# EAGLE design Stout IEEE full dev board (EAGLE 6.3)
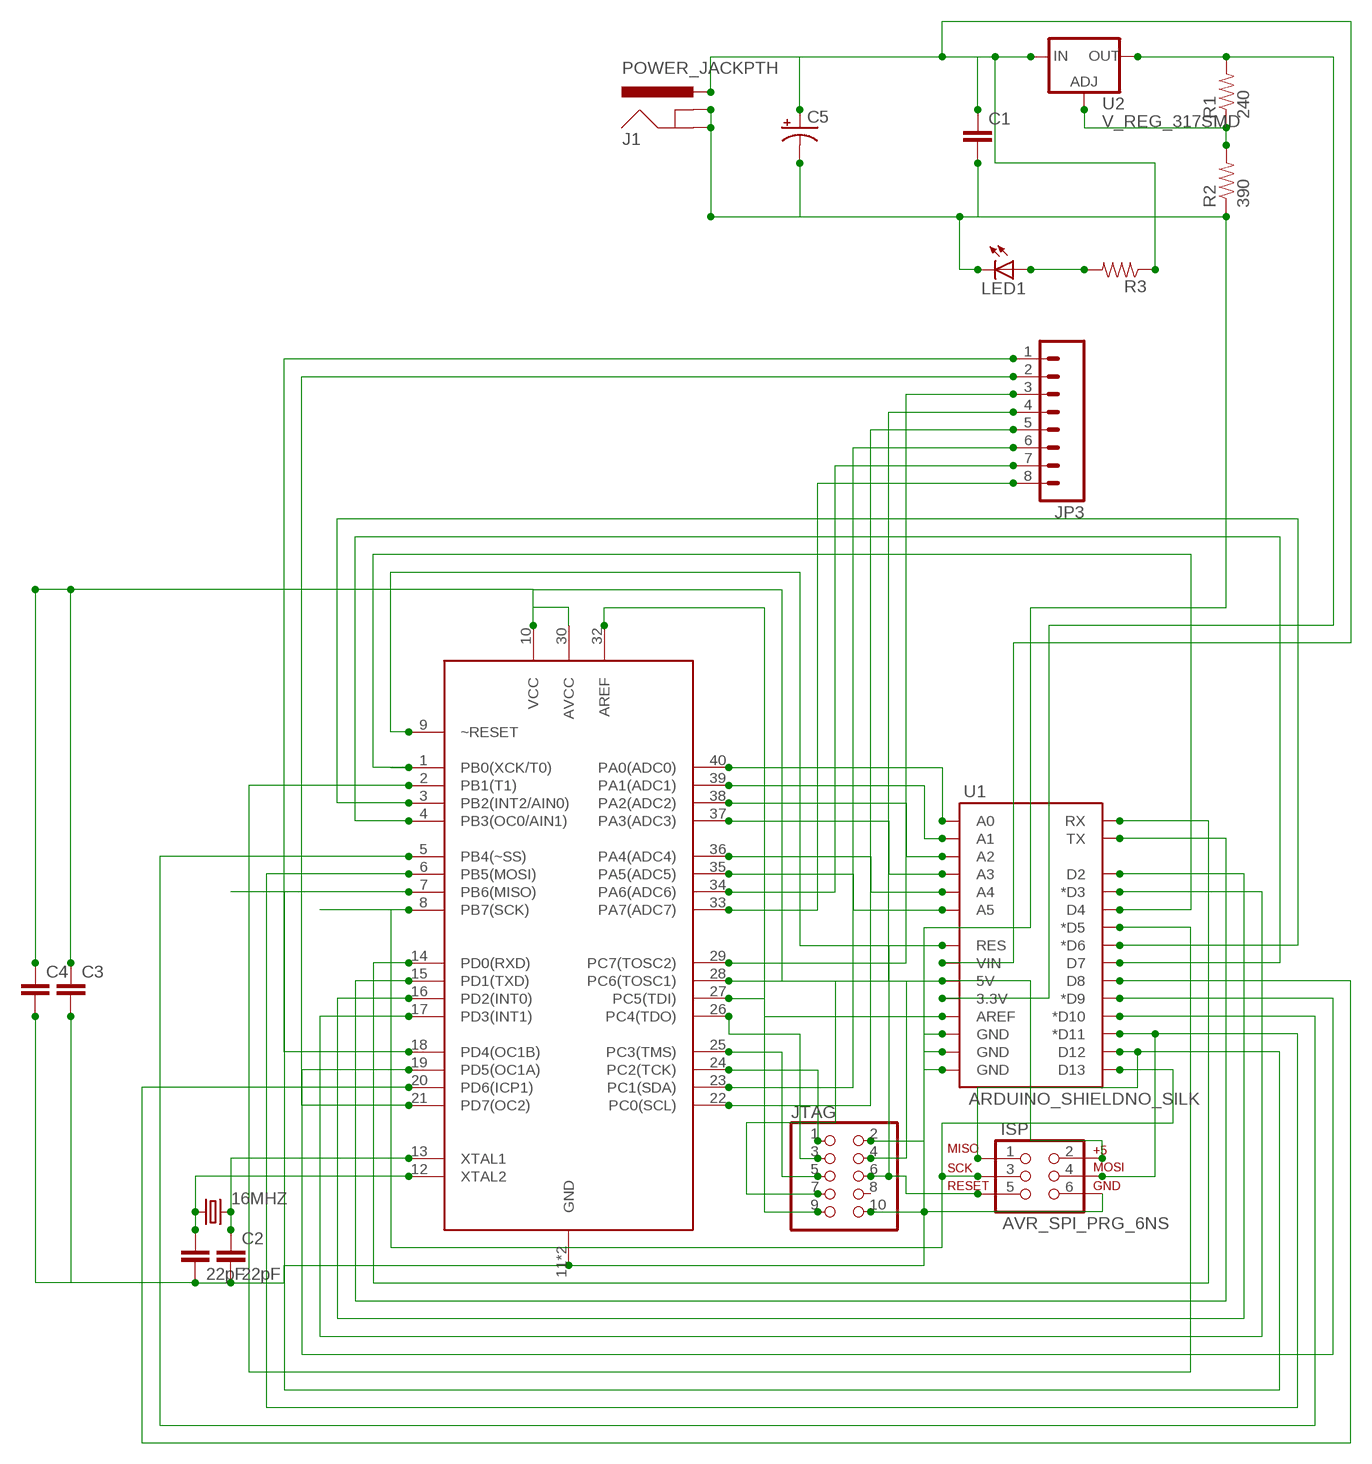
[diagram p0: schematic, sheet 1]

## Parts
16MHZ  CRYSTALHC49UV  [HC49U-V]
22PF  22pF  CAPPTH  [CAP-PTH-SMALL]
C1  CAPPTH  [CAP-PTH-SMALL]
C2  22pF  CAPPTH  [CAP-PTH-SMALL]
C3  CAPPTH  [CAP-PTH-SMALL]
C4  CAPPTH  [CAP-PTH-SMALL]
C5  CAP_POLPTH2  [CPOL-RADIAL-10UF-25V]
ISP  AVR_SPI_PRG_6NS  [2X3-NS]
J1  POWER_JACKPTH  [POWER_JACK_PTH]
JP3  M08  [1X08]
JTAG  PINHD-2X5  [2X05]
LED1  LED3MM  [LED3MM]
R1  240  RESISTORPTH1  [AXIAL-0.3]
R2  390  RESISTORPTH1  [AXIAL-0.3]
R3  RESISTORPTH1  [AXIAL-0.3]
U1  ARDUINO_SHIELDNO_SILK  [DUEMILANOVE_VIAS]
U2  V_REG_317SMD  [SOT223]
U$1  ATMEGA16  [40-DIP]

## Nets
GND: 22PF.2 C1.2 C2.2 C3.2 C4.2 C5.2(-) ISP.6 J1.GND J1.GNDBREAK JTAG.2 JTAG.10 LED1.K(C) R2.P$1 U1.GND@0(GND) U1.GND@1(GND) U1.GND@2(GND) U$1.11(GND) U$1.31(GND)
MISO: ISP.1 U1.D12 U$1.7(PB6(MISO))
MOSI: ISP.4 U1.D11(*D11) U$1.6(PB5(MOSI))
N$1: U1.A0 U$1.40(PA0(ADC0))
N$2: U1.A1 U$1.39(PA1(ADC1))
N$3: U1.A2 U$1.38(PA2(ADC2))
N$4: U1.A3 U$1.37(PA3(ADC3))
N$5: U1.A4 U$1.36(PA4(ADC4))
N$6: U1.A5 U$1.35(PA5(ADC5))
N$7: R1.P$2 U1.3.3V U2.2(OUT)
N$8: JP3.8 U$1.33(PA7(ADC7))
N$9: JP3.7 U$1.34(PA6(ADC6))
N$10: R1.P$1 R2.P$2 U2.1(ADJ)
N$11: U1.AREF U$1.32(AREF)
N$12: C1.1 C5.1(+) J1.PWR R3.P$1 U1.VIN U2.3(IN)
N$13: U1.RX U$1.14(PD0(RXD))
N$14: U1.TX U$1.15(PD1(TXD))
N$15: U1.D2 U$1.16(PD2(INT0))
N$16: U1.D3(*D3) U$1.17(PD3(INT1))
N$17: 16MHZ.2 C2.1 U$1.13(XTAL1)
N$18: 16MHZ.1 22PF.1 U$1.12(XTAL2)
N$19: JP3.6 U$1.23(PC1(SDA))
N$20: JP3.5 U$1.22(PC0(SCL))
N$21: U1.D4 U$1.1(PB0(XCK/T0))
N$22: U1.D8 U$1.20(PD6(ICP1))
N$23: LED1.A R3.P$2
N$24: U1.D10(*D10) U$1.5(PB4(~SS))
N$25: U1.D5(*D5) U$1.2(PB1(T1))
N$26: U1.D9(*D9) U$1.19(PD5(OC1A))
N$27: U1.D7 U$1.4(PB3(OC0/AIN1))
N$28: U1.D6(*D6) U$1.3(PB2(INT2/AIN0))
N$29: JTAG.1 U$1.24(PC2(TCK))
N$30: JTAG.3 U$1.26(PC4(TDO))
N$31: JTAG.5 U$1.25(PC3(TMS))
N$32: JTAG.9 U$1.27(PC5(TDI))
N$33: JP3.2 U$1.21(PD7(OC2))
N$34: JP3.1 U$1.18(PD4(OC1B))
N$35: JP3.4 U$1.28(PC6(TOSC1))
N$36: JP3.3 U$1.29(PC7(TOSC2))
RESET: ISP.5 JTAG.6 U1.RES U$1.9(~RESET)
SCK: ISP.3 U1.D13 U$1.8(PB7(SCK))
VCC: C3.1 C4.1 ISP.2 JTAG.4 JTAG.7 U1.5V U$1.10(VCC) U$1.30(AVCC)
Unconnected: JTAG.8

## Library data of the parts
16MHZ = SparkFun-FreqCtrl:CRYSTAL: Various standard crystals. Proven footprints. Spark Fun Electronics SKU : COM-00534
22PF C2 = SparkFun:CAP: Capacitor Standard 0603 ceramic capacitor, and 0.1" leaded capacitor.
C1 C3 C4 = 1x05smd:CAP: Capacitor Standard 0603 ceramic capacitor, and 0.1" leaded capacitor.
C5 = 1x05smd:CAP_POL: Capacitor Polarized These are standard SMD and PTH capacitors. Normally 10uF, 47uF, and 100uF in electrolytic and tantalum varieties. Always verify the external diameter of the through hole cap, it varies with capacity, voltage, and manufacturer. The EIA devices should be standard.
ISP = SparkFun:AVR_SPI_PRG_6: AVR ISP 6 Pin This is the reduced ISP connector for AVR programming. Common on Arduino. This footprint will take up less PCB space and can be used with a 10-pin to 6-pin adapter such as SKU: BOB-08508
J1 = SparkFun:POWER_JACK: Power Jack This is the standard 5.5mm barrel jack for power. The PTH is the most common, proven, reliable, footprint. All others are experimental. The Slot footprint only works if the mill layer is transmitted to the PCB fab house so be warned. Spark Fun Electronics SKU : PRT-00119. Mating wall wart : TOL-00298 (and others)
JP3 = SparkFun:M08: Header 8 Standard 8-pin 0.1" header. Use with straight break away headers (SKU : PRT-00116), right angle break away headers (PRT-00553), swiss pins (PRT-00743), machine pins (PRT-00117), and female headers (PRT-00115).
JTAG = pinhead:PINHD-2X5: PIN HEADER
LED1 = adafruit:LED: LED OSRAM: - CHIPLED LG R971, LG N971, LY N971, LG Q971, LY Q971, LO R971, LY R971 LH N974, LH R974 LS Q976, LO Q976, LY Q976 LO Q996 - Hyper CHIPLED LW Q18S LB Q993, LB Q99A, LB R99A - SideLED LS A670, LO A670, LY A670, LG A670, LP A670 LB A673, LV A673, LT A673, LW A673 LH A674 LY A675 LS A676, LA A676, LO A676, LY A676, LW A676 LS A679, LY A679, LG A679 - Hyper Micro SIDELED® LS Y876, LA Y876, LO Y876, LY Y876 LT Y87S - SmartLED LW L88C, LW L88S LB L89C, LB L89S, LG L890 LS L89K, LO L89K, LY L89K LS L896, LA L896, LO L896, LY L896 - TOPLED LS T670, LO T670, LY T670, LG T670, LP T670 LSG T670, LSP T670, LSY T670, LOP T670, LYG T670 LG T671, LOG T671, LSG T671 LB T673, LV T673, LT T673, LW T673 LH T674 LS T676, LA T676, LO T676, LY T676, LB T676, LH T676, LSB T676, LW T676 LB T67C, LV T67C, LT T67C, LS T67K, LO T67K, LY T67K, LW E67C LS E67B, LA E67B, LO E67B, LY E67B, LB E67C, LV E67C, LT E67C LW T67C LS T679, LY T679, LG T679 LS T770, LO T770, LY T770, LG T770, LP T770 LB T773, LV T773, LT T773, LW T773 LH T774 LS E675, LA E675, LY E675, LS T675 LS T776, LA T776, LO T776, LY T776, LB T776 LHGB T686 LT T68C, LB T68C - Hyper Mini TOPLED® LB M676 - Mini TOPLED Santana® LG M470 LS M47K, LO M47K, LY M47K Source: http://www.osram.convergy.de/
R1-R3 = 1x05smd:RESISTOR: Resistor Basic schematic elements and footprints for 0603, 1206, and PTH 1/10th watt (small) resistors.
U1 = SparkFun-Boards:ARDUINO_SHIELD: Arduino shield footprint
U2 = SparkFun-PowerIC:V_REG_317: Voltage Regulator Standard LM317 adjustable voltage regulator. AOI (Adjust Output Input). Google 'LM317 Calculator' for easy to use app to get the two resistor values needed. 240/720 for 5V output. 240/390 for 3.3V output. Spark Fun Electronics SKU : COM-00527
U$1 = Strutz Electronic Industries:ATMEGA16

## Board
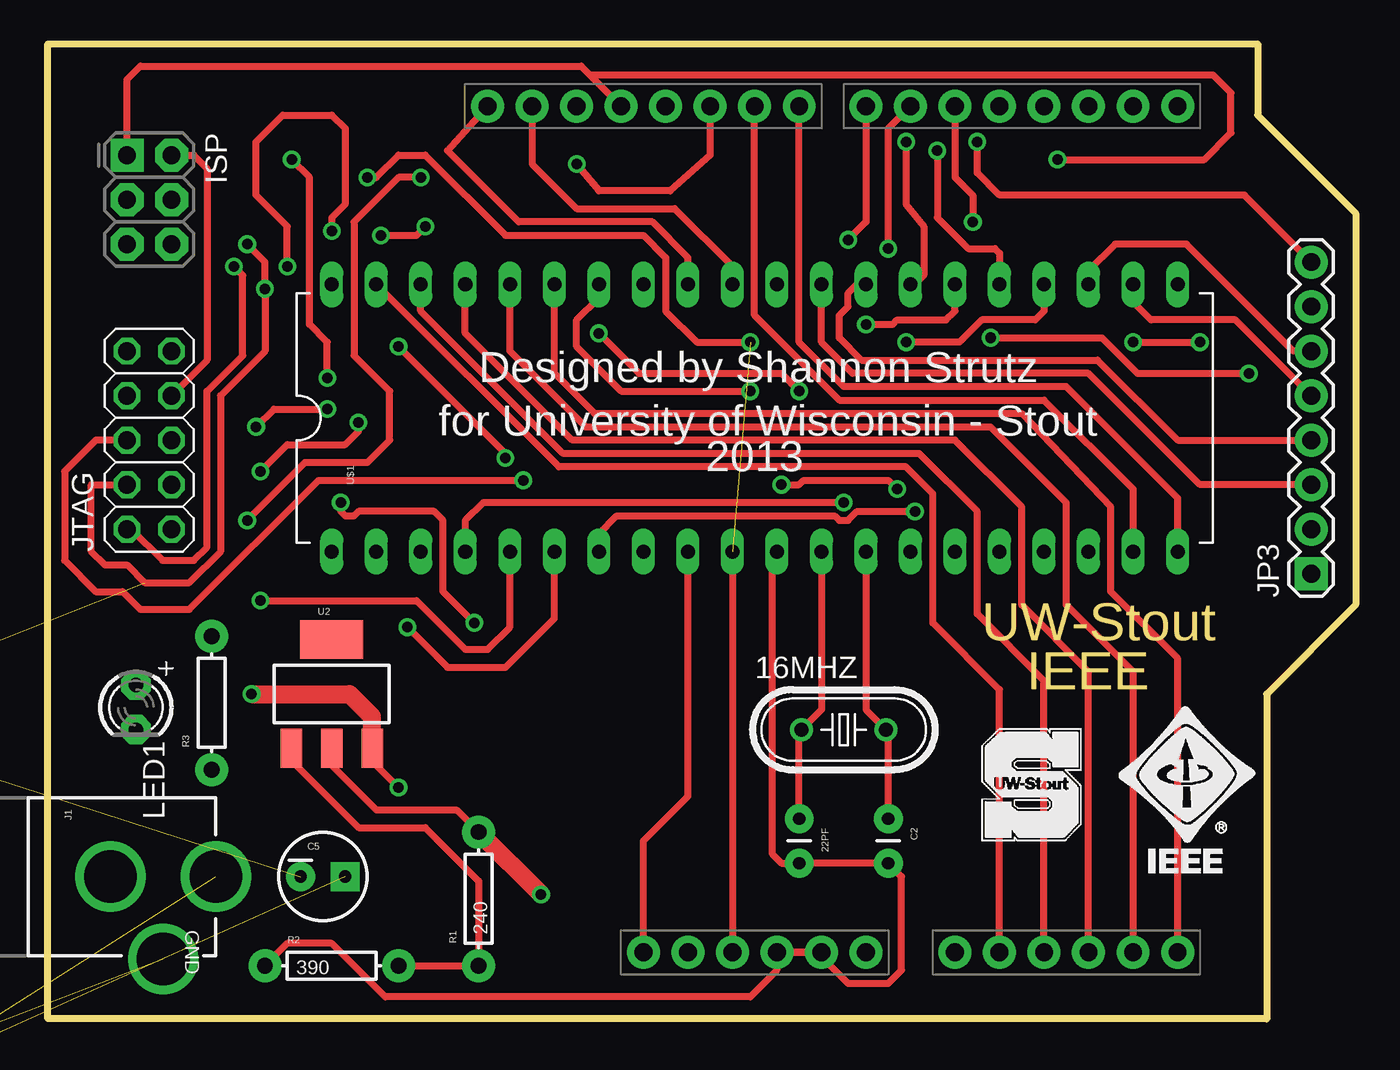
[diagram p1: board, top side]
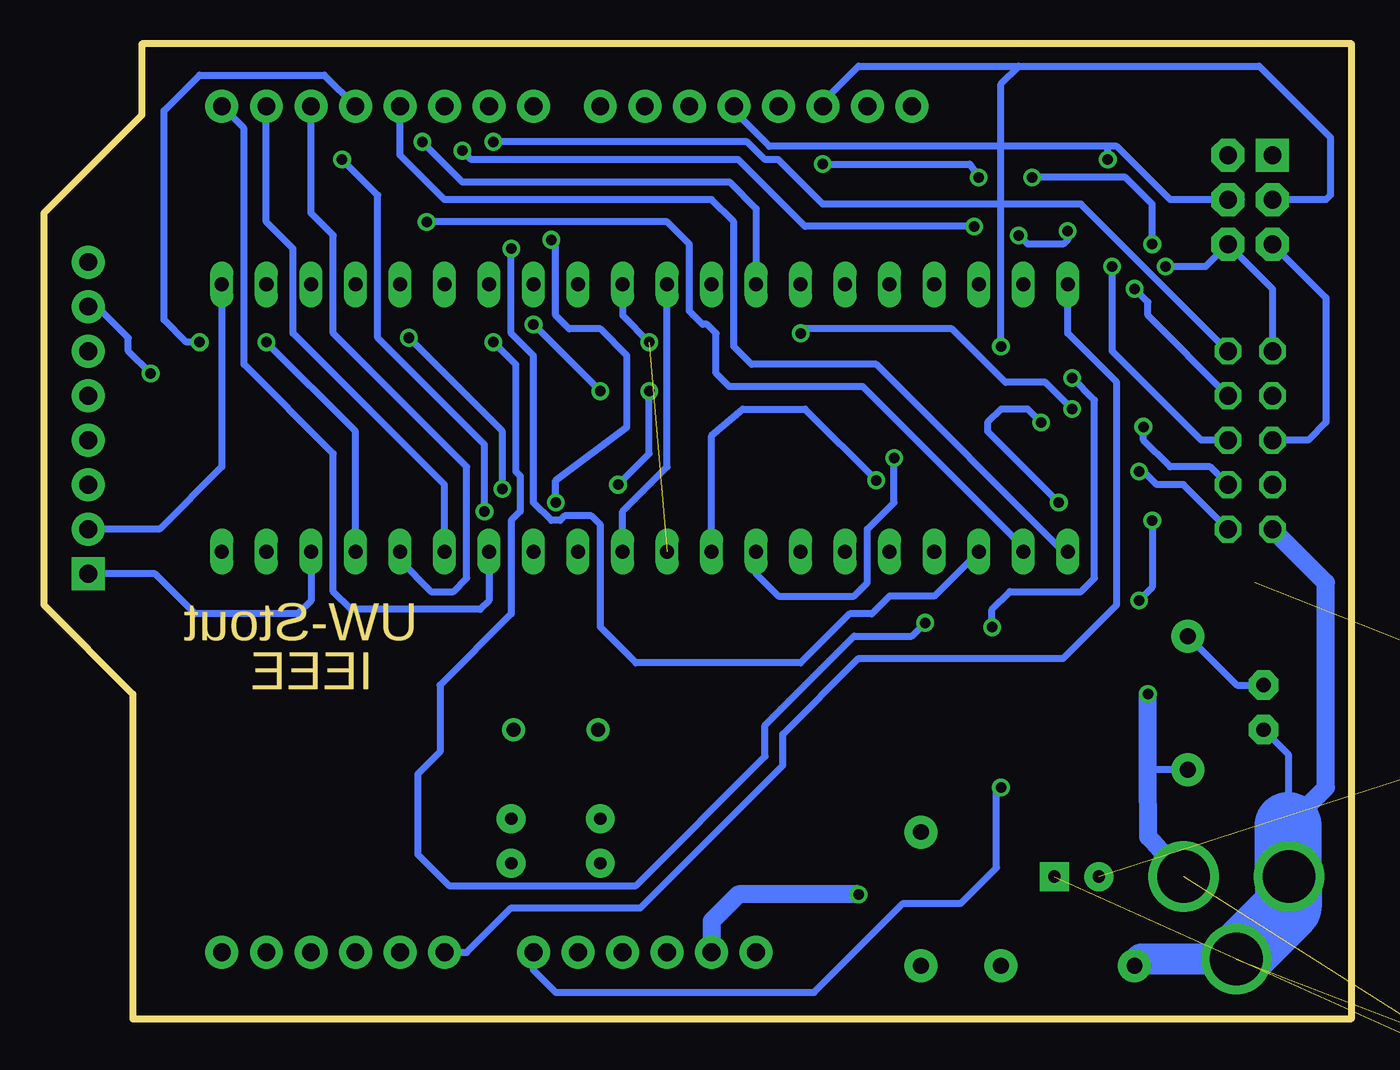
[diagram p2: board, bottom side, seen from below]

Size 74.63 x 55.63 mm. Coordinates in mm from the lower left corner, seen from the top.
Outline: 69.55,0.03 69.55,18.54 74.63,23.62 74.63,45.97 69.04,51.56 69.04,55.63 0,55.63 0,0.03 69.55,0.03
Outline: 69.55,0.03 69.55,0
Copper layers (1*16): Top 0.035mm / dielectric 1.5mm / Bottom 0.035mm
Design rules "default": minimum track width 10mil, minimum drill 24mil, track to track 8mil, track to pad 8mil, pad to pad 8mil, via to via 8mil, smd to smd 8mil, copper to edge 40mil, drill to drill 8mil, minimum pad ring 10mil, minimum via ring 8mil, stop-mask expansion 4mil, vias tented up to drill 0mil, thermal gap 10mil

### Footprints (pad centres in the part's own frame; a part is rotated, then mirrored left to right if it is on the bottom)
HC49U-V = drill 0.813: 1 -2.413,0; 2 2.413,0
CAP-PTH-SMALL = drill 0.7 pad 1.651: 1 0,0; 2 2.54,0
CPOL-RADIAL-10UF-25V = drill 0.7 pad 1.651 square: 1 1.27,0 | drill 0.7 pad 1.651: 2 -1.27,0
2X3-NS = drill 1.016 pad 1.88 square: 1 -2.54,-1.27 | drill 1.016 pad 1.88 octagon: 2 -2.54,1.27; 3 0,-1.27; 4 0,1.27; 5 2.54,-1.27; 6 2.54,1.27
POWER_JACK_PTH = drill 2.997: GND 0,7.7; GNDBREAK 4.7,10.7; PWR 0,13.7
1X08 = drill 1.016 pad 1.88 square: 1 0,0 | drill 1.016 pad 1.88: 2 2.54,0; 3 5.08,0; 4 7.62,0; 5 10.16,0; 6 12.7,0; 7 15.24,0; 8 17.78,0
2X05 = drill 1.016 octagon: 1 -5.08,-1.27; 2 -5.08,1.27; 3 -2.54,-1.27; 4 -2.54,1.27; 5 0,-1.27; 6 0,1.27; 7 2.54,-1.27; 8 2.54,1.27; 9 5.08,-1.27; 10 5.08,1.27
LED3MM = drill 0.813 pad 1.676 octagon: A -1.27,0; K 1.27,0
AXIAL-0.3 = drill 0.9 pad 1.88: P$1 -3.81,0; P$2 3.81,0
DUEMILANOVE_VIAS = drill 1.016 pad 1.88: 3.3V 50.8,13.97; 5V 50.8,16.51; A0 50.8,29.21; A1 50.8,31.75; A2 50.8,34.29; A3 50.8,36.83; A4 50.8,39.37; A5 50.8,41.91; AREF 2.54,2.54; D2 2.54,36.83; D3 2.54,34.29; D4 2.54,31.75; D5 2.54,29.21; D6 2.54,26.67; D7 2.54,24.13; D8 2.54,20.32; D9 2.54,17.78; D10 2.54,15.24; D11 2.54,12.7; D12 2.54,10.16; D13 2.54,7.62; GND@0 50.8,19.05; GND@1 50.8,21.59; GND@2 2.54,5.08; RES 50.8,11.43; RX 2.54,41.91; TX 2.54,39.37; VIN 50.8,24.13
SOT223 = smd 1.219 x 2.235: 1 -2.311,-3.099; 2 0,-3.099; 3 2.311,-3.099 | smd 3.6 x 2.2: 4 0,3.099
40-DIP = drill 0.8 long: 1 -7.62,24.13; 2 -7.62,21.59; 3 -7.62,19.05; 4 -7.62,16.51; 5 -7.62,13.97; 6 -7.62,11.43; 7 -7.62,8.89; 8 -7.62,6.35; 9 -7.62,3.81; 10 -7.62,1.27; 11 -7.62,-1.27; 12 -7.62,-3.81; 13 -7.62,-6.35; 14 -7.62,-8.89; 15 -7.62,-11.43; 16 -7.62,-13.97; 17 -7.62,-16.51; 18 -7.62,-19.05; 19 -7.62,-21.59; 20 -7.62,-24.13; 21 7.62,-24.13; 22 7.62,-21.59; 23 7.62,-19.05; 24 7.62,-16.51; 25 7.62,-13.97; 26 7.62,-11.43; 27 7.62,-8.89; 28 7.62,-6.35; 29 7.62,-3.81; 30 7.62,-1.27; 31 7.62,1.27; 32 7.62,3.81; 33 7.62,6.35; 34 7.62,8.89; 35 7.62,11.43; 36 7.62,13.97; 37 7.62,16.51; 38 7.62,19.05; 39 7.62,21.59; 40 7.62,24.13

### Placement (x,y rotation side)
16MHZ  45.42,16.51 0 top
22PF  42.88,11.43 270 top
C1  -8.43,-3.3 180 top  (outside the outline)
C2  47.96,11.43 270 top
C3  -15.04,16.76 0 top  (outside the outline)
C4  -17.58,9.14 0 top  (outside the outline)
C5  15.7,8.13 0 top
ISP  5.79,46.74 270 top
J1  -4.11,8.13 270 top
JP3  72.09,25.4 90 top
JTAG  5.79,33.02 90 top
LED1  5.03,17.78 270 top
R1  24.59,6.86 90 top
R2  16.21,3.05 0 top
R3  9.35,18.03 90 top
U1  22.56,54.61 270 top
U2  16.21,18.54 0 top
U$1  40.34,34.29 90 top
U$5  [IEEE_LOGO]  60.91,7.87 0 top
U$6  [STOUT_S]  53.29,10.16 0 top

### Tracks (layer width: path | path; a pad name or v marks a point on that pad's centre or on a via)
GND  (via drill 0.6)  (4 unrouted)
  Top 0.406: U1.GND@1 U1.GND@0 | U1.GND@0 41.61,2.79 40.08,1.27 19.25,1.27 16.21,4.32 13.67,4.32 R2.P$1 | U1.GND@2 27.64,48.77 30.18,46.23 35.76,46.23 39.07,42.93 U$1.31 | JTAG.2 4.78,27.94 6.55,26.16 8.33,26.16 9.09,26.92 9.09,35.81 11.13,37.85 11.13,42.42 v10.62,42.93 | U1.GND@0 43.89,3.81 45.67,2.03 47.96,2.03 48.72,2.79 48.72,8.13 C2.2 22PF.2 41.86,8.89 41.35,9.4 41.35,26.42 U$1.11
  Bottom 0.406: U$1.11 41.61,28.96 39.07,31.5 U$1.31 | JTAG.10 4.52,41.66 ISP.6 8.33,42.93 v10.62,42.93 | LED1.K 3.63,15.11 3.63,8.64
  Bottom 1.016: 4.72,11.74 3.63,11.05 1.47,13.21 1.47,24.89 JTAG.2
  Bottom 1.778: J1.GNDBREAK 12.02,3.43 R2.P$1
  Bottom 3.81: J1.GND 3.63,8.13 | 3.63,8.13 3.63,8.64 3.63,11.05 | 3.63,8.13 3.63,6.38 J1.GNDBREAK
MISO  (via drill 0.6)
  Top 0.406: ISP.1 4.52,53.59 5.28,54.36 30.43,54.36 30.94,53.85 | 30.94,53.85 U1.D12 | U$1.7 31.45,27.69 32.46,28.7 44.91,28.7 45.16,28.45 45.67,28.45 46.18,28.96 v49.48,28.96 | v57.61,49.02 65.99,49.02 67.51,50.55 67.51,52.83 66.5,53.85 30.94,53.85
  Bottom 0.406: v49.48,28.96 49.48,32.77 55.58,38.86 55.58,46.99 v57.61,49.02
MOSI  (via drill 0.6)
  Top 0.406: v15.95,36.58 15.95,38.61 14.94,39.62 14.94,48.01 v13.92,49.02 | v20.52,22.35 22.81,20.07 26.11,20.07 28.91,22.86 U$1.6
  Bottom 0.406: 6.3,46.74 ISP.4 10.36,46.74 13.41,49.78 13.92,49.78 | 13.92,49.78 33.22,49.78 35.26,51.82 U1.D11 | v20.52,22.35 20.52,23.37 19.51,24.38 15.44,24.38 14.68,25.15 14.68,35.31 v15.95,36.58 | v13.92,49.02 13.92,49.78
N$1
  Bottom 0.406: U1.A0 50.5,3.81 47.96,6.35 40.59,6.35 32.46,14.48 32.46,16.26 28.14,20.57 16.46,20.57 13.41,23.62 13.41,36.32 16.21,39.12 U$1.40
N$2
  Top 0.406: U1.A1 54.31,18.8 50.5,22.61 50.5,29.97 48.97,31.5 29.16,31.5 U$1.39
N$3
  Top 0.406: U1.A2 56.85,19.3 53.04,23.11 53.04,28.96 49.73,32.26 29.41,32.26 21.29,40.39 U$1.38
N$4
  Top 0.406: U1.A3 59.39,19.81 55.58,23.62 55.58,29.21 51.77,33.02 29.92,33.02 23.83,39.12 U$1.37
N$5
  Top 0.406: U1.A4 61.93,19.81 58.12,23.62 58.12,29.46 53.8,33.78 30.68,33.78 26.37,38.1 U$1.36
N$6
  Top 0.406: U1.A5 64.47,20.57 60.66,24.38 60.66,29.21 55.58,34.54 31.19,34.54 28.91,36.83 U$1.35
N$7  (via drill 0.6)
  Top 0.406: U2.2 16.21,14.48 18.75,11.94 23.32,11.94 R1.P$2
  Top 1.016: R1.P$2 v28.14,7.11
  Bottom 1.016: v28.14,7.11 35,7.11 36.53,5.59 U1.3.3V
N$8  (via drill 0.6)
  Top 0.406: JP3.8 68.28,46.99 54.31,46.99 53.04,48.26 v53.04,50.04
  Bottom 0.406: v53.04,50.04 50.75,47.75 35.51,47.75 33.99,46.23 U$1.33
N$9  (via drill 0.6)
  Top 0.406: v40.08,35.81 32.72,35.81 30.18,38.35 30.18,39.88 31.45,41.15 U$1.34 | v48.46,30.23 47.96,30.73 43.13,30.73 42.88,30.48 v41.86,30.48 | v53.8,38.86 60.15,38.86 62.18,36.83 v68.53,36.83
  Bottom 0.406: v48.46,30.23 48.46,33.53 v53.8,38.86 | v68.53,36.83 69.8,38.1 69.8,38.86 71.58,40.64 JP3.7 | v41.86,30.48 40.08,32.26 v40.08,35.81
N$10
  Top 0.406: R2.P$2 R1.P$1 24.59,7.87 21.54,10.92 17.73,10.92 13.92,14.73 13.92,15.21
  Top 1.016: 13.92,15.21 U2.1
N$11
  Top 0.406: U$1.32 36.53,43.43 34.49,45.47 26.87,45.47 22.81,49.53 U1.AREF
N$12  (via drill 0.6)  (2 unrouted)
  Top 0.406: v20.02,13.21 18.52,14.71 U2.3
  Top 1.016: v11.63,18.54 17.22,18.54 18.49,17.27 18.49,15.47 U2.3
  Bottom 0.406: U1.VIN 46.69,2.79 45.42,1.52 30.68,1.52 25.6,6.6 22.3,6.6 20.27,8.64 20.27,12.95 v20.02,13.21 | R3.P$1 11.63,14.22
  Bottom 1.016: J1.PWR 11.62,10.4 11.63,14.22 v11.63,18.54
N$13
  Bottom 0.406: U$1.14 49.23,23.88 49.73,23.37 57.1,23.37 58.12,24.38 58.12,32.26 63.2,37.34 63.2,50.8 U1.RX
N$14
  Bottom 0.406: U$1.15 51.77,30.48 60.4,39.12 60.4,43.94 61.93,45.47 U1.TX
N$15
  Bottom 0.406: U$1.16 54.31,26.16 52.53,24.38 51.26,24.38 50.5,25.15 50.5,31.5 58.12,39.12 58.12,44.7 59.39,45.97 U1.D2
N$16  (via drill 0.6)
  Top 0.406: v61.93,38.61 v65.74,38.61
  Bottom 0.406: U$1.17 56.85,33.53 v61.93,38.61 | v65.74,38.61 66.5,38.61 67.77,39.88 67.77,51.82 65.74,53.85 58.62,53.85 U1.D3
N$17
  Top 0.406: U$1.13 46.69,17.65 16MHZ.2 47.96,16.51 C2.1
N$18
  Top 0.406: U$1.12 44.15,17.65 16MHZ.1 42.88,16.38 22PF.1
N$19
  Top 0.406: JP3.6 71.07,38.1 64.97,44.2 60.91,44.2 59.39,42.67 U$1.23
N$20
  Top 0.406: JP3.5 67.77,39.88 62.94,39.88 61.93,40.89 U$1.22
N$21
  Bottom 0.406: U$1.1 16.46,26.67 27.13,37.34 34.24,37.34 35.26,38.35 35.26,45.47 36.53,46.74 51.77,46.74 54.31,49.28 U1.D4
N$22
  Top 0.406: U$1.20 64.47,29.72 58.12,36.07 45.42,36.07 42.88,38.61 U1.D8
N$23
  Bottom 0.406: R3.P$2 6.55,19.05 LED1.A
N$24  (via drill 0.6)
  Top 0.406: U1.D10 37.8,49.28 35.51,47.24 31.45,47.24 v30.18,48.77 | v21.29,48.01 20.02,48.01 17.48,45.47 17.48,37.85 19.51,35.81 19.51,33.02 18.24,31.75 14.68,31.75 v11.38,28.45 | v12.14,23.88 21.03,23.88 23.83,21.08 25.1,21.08 26.37,22.35 U$1.5
  Bottom 0.406: v30.18,48.77 21.79,48.77 v21.29,48.01 | v11.38,28.45 11.38,24.64 v12.14,23.88
N$25  (via drill 0.6)
  Top 0.406: U1.D5 51.77,48.01 52.78,46.99 v52.78,45.47
  Bottom 0.406: U$1.2 18.75,26.92 27.89,36.07 35.51,36.07 36.27,36.83 36.27,39.12 36.78,39.62 37.03,39.62 37.8,40.39 37.8,44.2 39.07,45.47 v52.78,45.47
N$26
  Top 0.406: U$1.19 61.93,30.23 56.85,35.31 45.16,35.31 40.34,40.13 U1.D9
N$27  (via drill 0.6)
  Top 0.406: U1.D7 46.69,45.47 v45.67,44.45 | v45.42,29.46 24.84,29.46 23.83,28.45 U$1.4
  Bottom 0.406: v45.42,29.46 45.42,30.73 41.35,33.78 41.35,37.85 42.88,39.37 44.65,39.37 45.42,40.13 45.42,44.2 v45.67,44.45
N$28  (via drill 0.6)
  Top 0.406: v47.96,43.94 47.96,50.8 U1.D6
  Bottom 0.406: U$1.3 23.83,24.13 26.37,24.13 27.38,23.11 28.65,23.11 31.45,20.32 40.84,20.32 42.88,22.35 42.88,28.19 43.38,28.7 44.91,28.7 45.16,28.45 45.67,28.45 46.69,29.46 46.69,37.85 47.96,39.12 v47.96,43.94
N$29  (via drill 0.6)
  Top 0.406: U$1.24 56.85,40.39 56.34,39.88 53.29,39.88 52.02,38.61 v48.97,38.61 | v12.14,31.24 13.67,32.77 16.97,32.77 17.73,33.53 v17.73,34.04 | v16.71,29.46 16.71,28.96 16.97,28.7 17.48,28.7 17.73,28.96 22.05,28.96 22.56,28.45 22.56,24.38 v24.33,22.61
  Bottom 0.406: v48.97,38.61 47.7,37.34 47.7,31.24 47.45,30.99 47.45,28.96 47.96,28.45 47.96,23.11 52.02,19.05 52.02,15.24 53.29,13.97 53.29,9.4 51.51,7.62 40.84,7.62 33.48,14.99 33.48,16.76 28.4,21.84 25.1,21.84 v24.33,22.61 | JTAG.1 9.6,30.48 11.13,30.48 11.89,31.24 v12.14,31.24 | v17.73,34.04 18.49,34.8 20.02,34.8 20.78,34.04 20.78,33.53 v16.71,29.46
N$30  (via drill 0.6)
  Top 0.406: v11.89,33.78 12.9,34.8 v15.95,34.8 | v31.45,39.12 33.73,36.83 41.86,36.83 v42.88,35.81 | v46.69,39.62 48.21,39.62 48.46,39.88 51.26,39.88 51.77,40.39 U$1.26
  Bottom 0.406: JTAG.3 8.08,31.5 10.36,31.5 11.89,33.02 v11.89,33.78 | v15.95,34.8 17.48,36.32 19.76,36.32 22.81,39.37 31.19,39.37 v31.45,39.12 | v42.88,35.81 v46.69,39.62
N$31  (via drill 0.6)
  Top 0.406: v13.67,42.93 13.67,45.21 11.89,46.99 11.89,50.04 13.41,51.56 16.21,51.56 16.97,50.8 16.97,46.48 16.21,45.72 v16.21,44.96 | v19,44.7 21.03,44.7 v21.54,45.21 | v50.75,49.53 50.75,45.72 52.53,43.94 54.05,43.94 54.31,43.69 U$1.25
  Bottom 0.406: JTAG.5 8.59,33.02 13.67,38.1 v13.67,42.93 | v16.21,44.96 16.21,44.45 16.46,44.2 18.49,44.2 v19,44.7 | v21.54,45.21 31.19,45.21 35,49.02 50.24,49.02 v50.75,49.53
N$32  (via drill 0.6)
  Top 0.406: v48.97,50.04 48.97,46.48 49.99,45.21 49.99,42.42 49.48,41.91 U$1.27
  Bottom 0.406: JTAG.9 15.44,46.48 30.18,46.48 32.72,49.02 33.48,49.02 34.49,50.04 v48.97,50.04
N$33
  Bottom 0.406: U$1.21 64.47,31.5 68.02,27.94 JP3.2
N$34
  Bottom 0.406: U$1.18 59.39,23.88 60.15,23.11 65.99,23.11 68.28,25.4 JP3.1
N$35
  Top 0.406: JP3.4 64.47,33.02 59.89,37.59 46.43,37.59 45.16,38.86 45.16,40.13 45.67,40.64 45.67,41.4 46.18,41.91 U$1.28
N$36
  Top 0.406: JP3.3 65.74,30.48 59.39,36.83 45.92,36.83 44.15,38.61 U$1.29
RESET  (via drill 0.6)
  Top 0.406: U1.RES 33.99,10.16 36.53,12.7 U$1.9 | JTAG.6 2.74,33.02 0.97,31.24 0.97,26.16 2.74,24.38 4.27,24.38 5.28,23.37 8.08,23.37 15.44,30.73 v27.13,30.73
  Bottom 0.406: U$1.9 36.53,33.27 34.75,34.8 31.19,34.8 v27.13,30.73 | ISP.5 1.47,41.15 1.47,34.04 2.49,33.02 JTAG.6
SCK  (via drill 0.6)
  Top 0.406: v26.11,32 26.11,32.26 v20.02,38.35
  Bottom 0.406: U1.D13 30.18,52.32 28.14,54.36 19,54.36 | 19,54.36 5.28,54.36 1.22,50.29 1.22,46.99 1.47,46.74 ISP.3 | U$1.8 33.99,25.4 32.72,24.13 28.4,24.13 27.64,24.89 27.64,27.94 26.11,29.46 v26.11,32 | v20.02,38.35 20.02,53.34 19,54.36
VCC  (via drill 0.6)  (3 unrouted)
  Top 0.406: ISP.2 8.33,49.28 9.09,48.51 9.09,37.59 JTAG.7 | JTAG.4 2.49,30.48 2.49,26.67 3.25,25.91 4.52,25.91 5.54,24.89 8.08,24.89 9.86,26.67 9.86,35.56 12.4,38.1 v12.4,41.66 12.4,43.18 v11.38,44.2 | v18.24,48.01 18.75,48.01 20.02,49.28 21.54,49.28 26.11,44.7 33.99,44.7 35.26,43.43 35.26,40.39 37.03,38.61 v40.08,38.61 | 38.81,26.42 U$1.10 U1.5V
  Bottom 0.406: U$1.30 41.61,40.13 v40.08,38.61 | v11.38,44.2 11.38,46.48 12.9,48.01 v18.24,48.01 | JTAG.7 11.63,40.13 11.63,40.89 v12.4,41.66

### Text on the board
Dimension: UW-Stout | IEEE
tSilk: Designed by Shannon Strutz | for University of Wisconsin - Stout | 2013 | GND